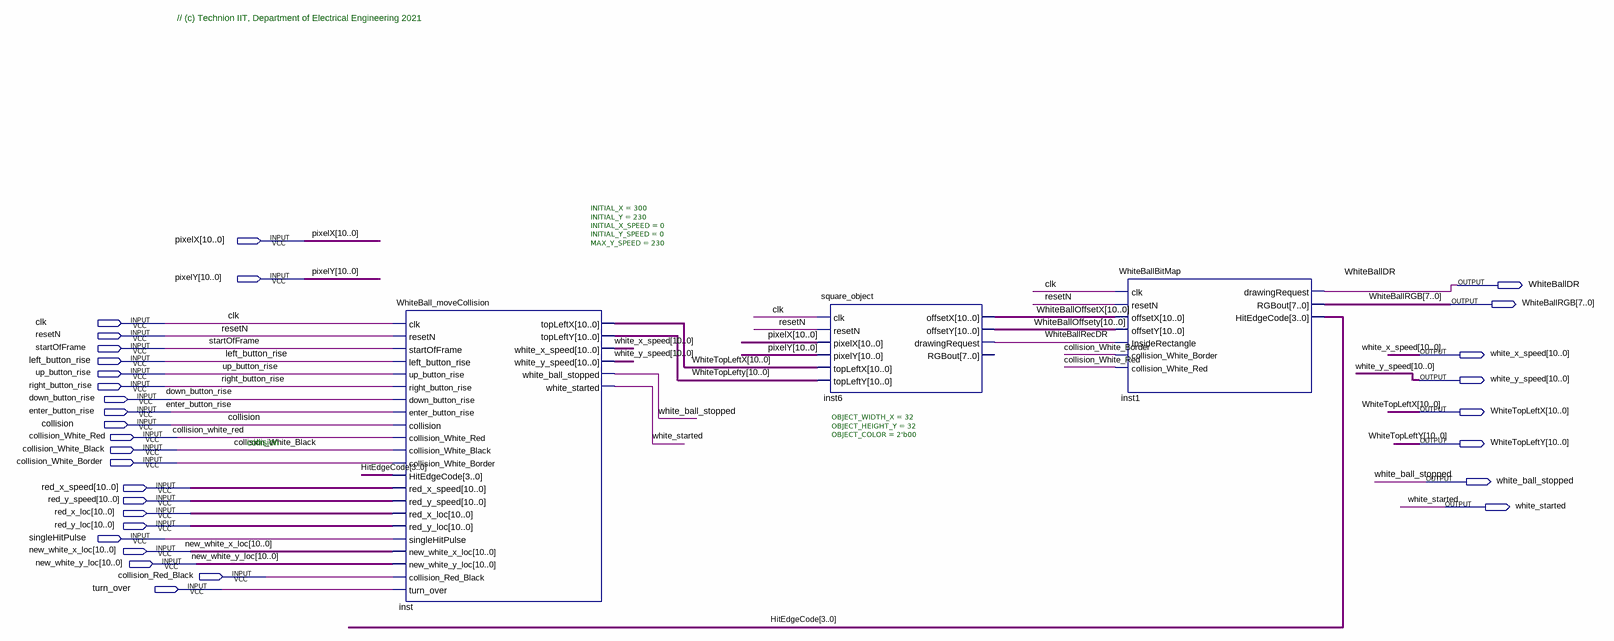
[diagram p0: schematic sheet]
// Quartus schematic WhiteBall_Block.bdf as structural Verilog: 3 symbols, 31 pins
module WhiteBall_Block (
  input  [10:0] pixelX,
  input  [10:0] pixelY,
  input  clk,
  input  resetN,
  input  startOfFrame,
  input  left_button_rise,
  input  up_button_rise,
  input  right_button_rise,
  input  down_button_rise,
  input  enter_button_rise,
  input  collision,
  input  collision_White_Red,
  input  collision_White_Black,
  input  collision_White_Border,
  input  [10:0] red_x_speed,
  input  [10:0] red_y_speed,
  input  [10:0] red_x_loc,
  input  [10:0] red_y_loc,
  input  singleHitPulse,
  input  [10:0] new_white_x_loc,
  input  [10:0] new_white_y_loc,
  input  collision_Red_Black,
  input  turn_over,
  output WhiteBallDR,
  output [7:0] WhiteBallRGB,
  output [10:0] white_x_speed,
  output [10:0] white_y_speed,
  output [10:0] WhiteTopLeftX,
  output [10:0] WhiteTopLeftY,
  output white_ball_stopped,
  output white_started
);

  wire WhiteBallRecDR;
  wire [3:0] HitEdgeCode;
  wire [10:0] WhiteBallOffsetX, WhiteBallOffsety;

  WhiteBall_moveCollision #(.INITIAL_X(300), .INITIAL_Y(230), .INITIAL_X_SPEED(0), .INITIAL_Y_SPEED(0), .MAX_Y_SPEED(230)) inst (
    .clk(clk), .resetN(resetN), .startOfFrame(startOfFrame), .left_button_rise(left_button_rise),
    .up_button_rise(up_button_rise), .right_button_rise(right_button_rise),
    .down_button_rise(down_button_rise), .enter_button_rise(enter_button_rise), .collision(collision),
    .collision_White_Red(collision_White_Red), .collision_White_Black(collision_White_Black),
    .collision_White_Border(collision_White_Border), .HitEdgeCode(HitEdgeCode), .red_x_speed(red_x_speed),
    .red_y_speed(red_y_speed), .red_x_loc(red_x_loc), .red_y_loc(red_y_loc), .singleHitPulse(singleHitPulse),
    .new_white_x_loc(new_white_x_loc), .new_white_y_loc(new_white_y_loc),
    .collision_Red_Black(collision_Red_Black), .turn_over(turn_over), .topLeftX(WhiteTopLeftX),
    .topLeftY(WhiteTopLeftY), .white_x_speed(white_x_speed), .white_y_speed(white_y_speed),
    .white_ball_stopped(white_ball_stopped), .white_started(white_started));
  square_object #(.OBJECT_WIDTH_X(32), .OBJECT_HEIGHT_Y(32), .OBJECT_COLOR(2'b00)) inst6 (
    .clk(clk), .resetN(resetN), .pixelX(pixelX), .pixelY(pixelY), .topLeftX(WhiteTopLeftX),
    .topLeftY(WhiteTopLeftY), .offsetX(WhiteBallOffsetX), .offsetY(WhiteBallOffsety),
    .drawingRequest(WhiteBallRecDR));  // open: RGBout
  WhiteBallBitMap inst1 (
    .clk(clk), .resetN(resetN), .offsetX(WhiteBallOffsetX), .offsetY(WhiteBallOffsety),
    .InsideRectangle(WhiteBallRecDR), .collision_White_Border(collision_White_Border),
    .collision_White_Red(collision_White_Red), .drawingRequest(WhiteBallDR), .RGBout(WhiteBallRGB),
    .HitEdgeCode(HitEdgeCode));

  // Notes on the sheet:
  //   // (c) Technion IIT, Department of Electrical Engineering 2021
  //   collision
endmodule
